# EAGLE design Relay Module V1 (EAGLE 8.5.0)
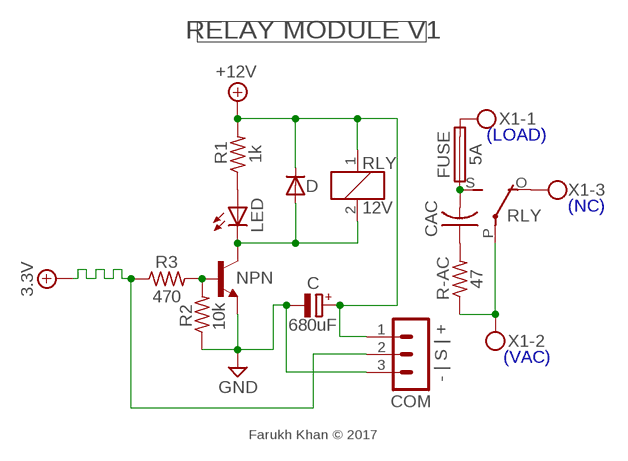
[diagram p0: schematic, sheet 1]

## Parts
C  680uF  CPOL-EUE3.5-10  [E3,5-10]
CAC  C-US150-064X183  [C150-064X183]
COM  - | S | +  MA03-1  [MA03-1]
D  1N4004  [DO41-10]
FUSE  5A  SH22  [SH22]
LED  LED3MM  [LED3MM]
NPN  2N2222A  [TO18]
R1  1k  R-US_0204/7  [0204/7]
R2  10k  R-US_0204/7  [0204/7]
R3  470  R-US_0204/7  [0204/7]
R-AC  47  R-US_0617/17  [0617/17]
RLY  12V  G5LE  [G5LE]
X1  MKDSN1,5/3-5,08  [MKDSN1,5/3-5,08]

## Nets
+5V: COM.2 R3.1 ; supply symbol labelled 3.3V
+12V: C.+ COM.1 D.C R1.2 RLY.1
GND: C.- COM.3 NPN.1(E) R2.1
N$1: LED.A R1.1
N$2: D.A LED.K(C) NPN.3(C) RLY.2
N$3: NPN.2(B) R2.2 R3.2
N$4: FUSE.2 X1.1
N$5: R-AC.1 RLY.P(2:P) X1.2
N$6: CAC.1 R-AC.2
N$7: CAC.2 FUSE.1 RLY.S(2:S)
N$8: RLY.O(2:O) X1.3

## Notes on the sheet
- RELAY MODULE V1
- (LOAD)
- (NC)
- (VAC)
- Farukh Khan © 2017

## Library data of the parts
C = resistor:CPOL-EU: POLARIZED CAPACITOR, European symbol
CAC = resistor:C-US: CAPACITOR, American symbol
COM = con-lstb:MA03-1: PIN HEADER; OC_FARNELL: unknown; OC_NEWARK: unknown
D = diode:1N4004: DIODE general purpose rectifier, 1 A
FUSE = fuse:SH22: FUSE HOLDER CS PFP30, Schukat; OC_FARNELL: unknown; OC_NEWARK: unknown
LED = led:LED: LED OSRAM: - CHIPLED LG R971, LG N971, LY N971, LG Q971, LY Q971, LO R971, LY R971 LH N974, LH R974 LS Q976, LO Q976, LY Q976 LO Q996 - Hyper CHIPLED LW Q18S LB Q993, LB Q99A, LB R99A - SideLED LS A670, LO A670, LY A670, LG A670, LP A670 LB A673, LV A673, LT A673, LW A673 LH A674 LY A675 LS A676, LA A676, LO A676, LY A676, LW A676 LS A679, LY A679, LG A679 - Hyper Micro SIDELED® LS Y876, LA Y876, LO Y876, LY Y876 LT Y87S - SmartLED LW L88C, LW L88S LB L89C, LB L89S, LG L890 LS L89K, LO L89K, LY L89K LS L896, LA L896, LO L896, LY L896 - TOPLED LS T670, LO T670, LY T670, LG T670, LP T670 LSG T670, LSP T670, LSY T670, LOP T670, LYG T670 LG T671, LOG T671, LSG T671 LB T673, LV T673, LT T673, LW T673 LH T674 LS T676, LA T676, LO T676, LY T676, LB T676, LH T676, LSB T676, LW T676 LB T67C, LV T67C, LT T67C, LS T67K, LO T67K, LY T67K, LW E67C LS E67B, LA E67B, LO E67B, LY E67B, LB E67C, LV E67C, LT E67C LW T67C LS T679, LY T679, LG T679 LS T770, LO T770, LY T770, LG T770, LP T770 LB T773, LV T773, LT T773, LW T773 LH T774 LS E675, LA E675, LY E675, LS T675 LS T776, LA T776, LO T776, LY T776, LB T776 LHGB T686 LT T68C, LB T68C - Hyper Mini TOPLED® LB M676 - Mini TOPLED Santana® LG M470 LS M47K, LO M47K, LY M47K Source: http://www.osram.convergy.de LUXEON: - LUMILED® LXK2-PW12-R00, LXK2-PW12-S00, LXK2-PW14-U00, LXK2-PW14-V00 LXK2-PM12-R00, LXK2-PM12-S00, LXK2-PM14-U00 LXK2-PE12-Q00, LXK2-PE12-R00, LXK2-PE12-S00, LXK2-PE14-T00, LXK2-PE14-U00 LXK2-PB12-K00, LXK2-PB12-L00, LXK2-PB12-M00, LXK2-PB14-N00, LXK2-PB14-P00, LXK2-PB14-Q00 LXK2-PR12-L00, LXK2-PR12-M00, LXK2-PR14-Q00, LXK2-PR14-R00 LXK2-PD12-Q00, LXK2-PD12-R00, LXK2-PD12-S00 LXK2-PH12-R00, LXK2-PH12-S00 LXK2-PL12-P00, LXK2-PL12-Q00, LXK2-PL12-R00 Source: www.luxeon.com KINGBRIGHT: KA-3528ASYC Source: www.kingbright.com
NPN = transistor-npn:2N2222*: NPN Transistor
R1-R3 R-AC = resistor:R-US_: RESISTOR, American symbol
RLY = relay:G5LE: RELAY 1 x switch, 10 A/120 V AC, 8 A/30 V DC, Omron; OC_FARNELL: unknown; OC_NEWARK: unknown
X1 = con-phoenix-508:MKDSN1,5/3-5,08: MKDSN 1,5/ 3-5,08 Printklemme Nennstrom: 13,5 A Nennspannung: 250 V Rastermaß: 5,08 mm Polzahl: 3 Anschlussart: Schraubanschluss Montage: Löten Anschlussrichtung Leiter/Platine: 0 ° Artikelnummer: 1729131 Source: http://eshop.phoenixcontact.com .. 1729131.pdf

## Net classes
0 default: width 0.635 mm, drill 0.127 mm, clearance 0.33 mm

## Board
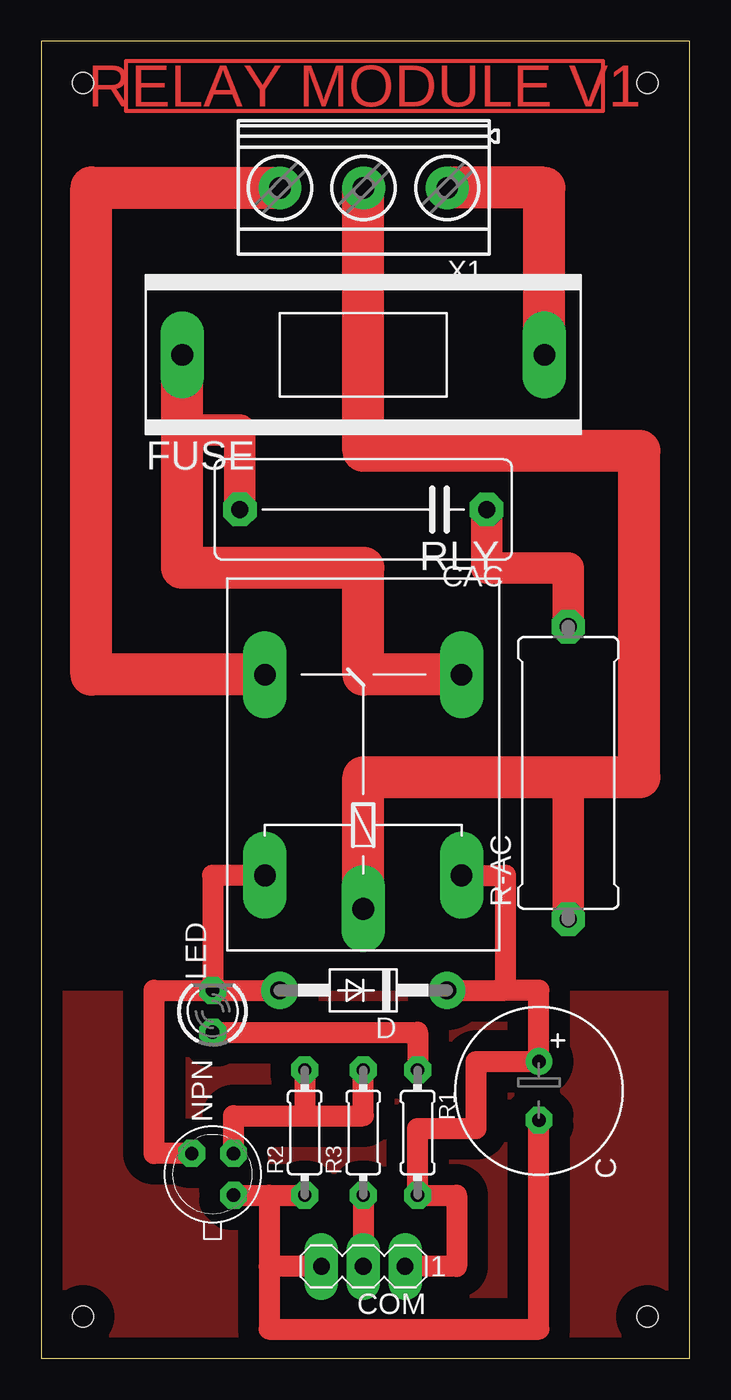
[diagram p1: board, top side]

Size 39.38 x 80.01 mm. Coordinates in mm from the lower left corner, seen from the top.
Outline: 0,0 39.38,0 39.38,80.01 0,80.01 0,0
Copper layers (1*16): Top 0.035mm / dielectric 1.5mm / Bottom 0.035mm
Design rules "default *": minimum track width 7mil, minimum drill 0.35mm, track to track 7mil, track to pad 7mil, pad to pad 7mil, via to via 7mil, smd to smd 7mil, copper to edge 30mil, drill to drill 7mil, minimum pad ring 10mil, minimum via ring 7mil, stop-mask expansion 5mil, vias tented up to drill 0mil, thermal gap 10mil
Holes 1.27 mm at 2.54,2.54 36.83,77.47 36.83,2.54 2.54,77.47

### Footprints (pad centres in the part's own frame; a part is rotated, then mirrored left to right if it is on the bottom)
E3,5-10 = drill 0.813 pad 1.6: + -1.778,0 | drill 0.813 pad 1.6 octagon: - 1.778,0
C150-064X183 = drill 1.016 octagon: 1 -7.493,0; 2 7.493,0
MA03-1 = drill 1.016 long: 1 -2.54,0; 2 0,0; 3 2.54,0
DO41-10 = drill 1.118: A 5.08,0; C -5.08,0
SH22 = drill 1.321 pad 2.54 long: 1 -10.998,0; 2 10.998,0
LED3MM = drill 0.813 octagon: A -1.27,0; K 1.27,0
TO18 = drill 0.813 octagon: 1 -1.27,-1.27; 2 1.27,-1.27; 3 1.27,1.27
0204/7 = drill 0.813 octagon: 1 -3.81,0; 2 3.81,0
0617/17 = drill 1.016 octagon: 1 -8.89,0; 2 8.89,0
G5LE = drill 1.321 long: 1 -7.493,-5.969; 2 -7.493,5.969; O 4.699,5.969; P -9.525,0; S 4.699,-5.969
MKDSN1,5/3-5,08 = drill 1.3 pad 2: 1 -7.641,0.025; 2 -2.561,0.025; 3 2.519,0.025

### Placement (x,y rotation side)
C  30.23,16.26 270 top
CAC  19.56,51.56 180 top
COM  19.56,5.59 180 top
D  19.56,22.35 180 top
FUSE  19.56,60.96 0 top
LED  10.41,21.08 90 top
NPN  10.41,11.18 90 top
R1  22.86,13.72 270 top
R2  16,13.72 90 top
R3  19.56,13.72 90 top
R-AC  32,35.56 90 top
RLY  19.56,36.83 90 top
X1  17.02,71.12 180 top

### Tracks (layer width: path | path; a pad name or v marks a point on that pad's centre or on a via)
+5V
  Top 1.27: R3.1 COM.2
+12V
  Top 1.27: 28.19,22.35 30.23,22.35 C.+ 26.42,18.03 26.42,13.97 22.86,13.97 R1.2 25.22,9.91 25.22,5.59 COM.1 | RLY.1 28.19,29.34 28.19,22.35 | D.C 28.19,22.35
GND
  Top 1.27: NPN.1 13.84,9.91 | 13.84,9.91 R2.1 | 13.84,9.91 13.84,5.59 | 13.84,5.59 13.84,1.78 30.23,1.78 C.- | COM.3 13.84,5.59
N$1
  Top 1.27: LED.A 22.86,19.81 R1.1
N$2
  Top 1.27: RLY.2 10.41,29.34 LED.K | NPN.3 6.86,12.45 6.86,22.35 LED.K | LED.K D.A
N$3
  Top 1.27: NPN.2 11.68,14.73 16,14.73 | 16,14.73 19.56,14.73 R3.2 | R2.2 16,14.73
N$4
  Top 2.54: FUSE.2 30.56,71.09 X1.1
N$5
  Top 1.905: R-AC.1 32,35.31
  Top 2.54: RLY.P 19.56,35.31 32,35.31 36.32,35.31 36.32,55.12 19.56,55.12 19.56,71.09 X1.2
N$6
  Top 1.905: CAC.1 27.05,48.01 32,48.01 R-AC.2
N$7
  Top 1.905: CAC.2 12.06,56.39 8.56,56.39
  Top 2.54: RLY.S 19.56,41.53 19.56,48.01 8.56,48.01 8.56,56.39 FUSE.1
N$8
  Top 2.54: RLY.O 3.05,41.53 3.05,71.12 14.5,71.12 X1.3
N$9
  Top 0.254: 5.16,78.82 34.11,78.82 34.11,75.77 5.16,75.77 5.16,78.82
N$10
  pour Top (isolate 1.27, rank 3): 0.25,22.23 39.12,22.23 39.12,0.25 0.25,0.25

### Text on the board
Top: RELAY MODULE V1